# EAGLE design ESP-AXA (EAGLE 9.6.2)
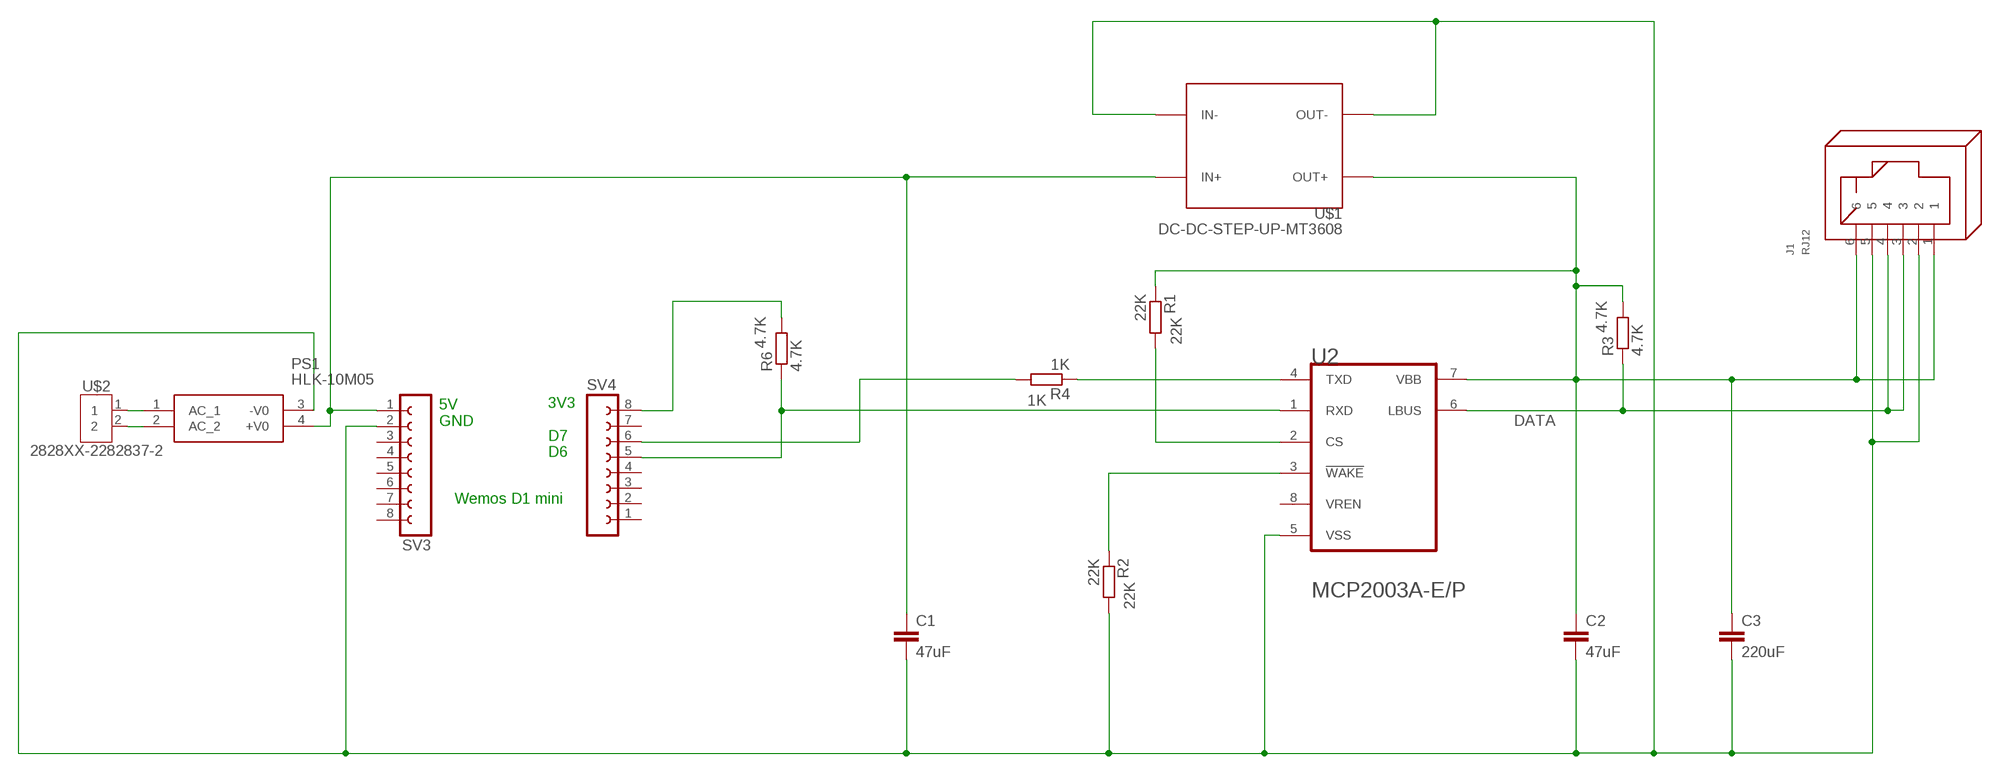
[diagram p0: schematic, sheet 1]

## Parts
C1  47uF  C7.5/3  [C7.5B3]
C2  47uF  C7.5/3  [C7.5B3]
C3  220uF  C7.5/3  [C7.5B3]
J1  RJ12  [RJ12]
PS1  HLK-10M05  [HLK10M05]
R1  22K  R-EU_0204/2V  [0204V]
R2  22K  R-EU_0204/2V  [0204V]
R3  4.7K  R-EU_0204/2V  [0204V]
R4  1K  R-EU_0204/2V  [0204V]
R6  4.7K  R-EU_0204/2V  [0204V]
SV3  FE08-1  [FE08]
SV4  FE08-1  [FE08]
U2  MICROCHIP_MCP2003A-E-PMICROCHIP_MCP2003A-E-P_0_0  [MICROCHIP_MCP2003A-E-P_0]
U$1  DC-DC-STEP-UP-MT3608  [DC-DC-STEP-UP-MT3608]
U$2  2828XX-2282837-2  [TERMBLK_508-2N]

## Nets
5V: C1.1 PS1.4(+V0) SV3.1 U$1.IN+
8V: C2.1 C3.1 J1.1 J1.6 R1.1 R3.2 U2.7(VBB) U$1.OUT+
240VAC: PS1.2(AC_2) U$2.2
CS: R1.2 U2.2(CS)
DATA: J1.3 J1.4 R3.1 U2.6(LBUS)
GND: C1.2 C2.2 C3.2 J1.2 J1.5 PS1.3(-V0) R2.2 SV3.2 U2.5(VSS) U$1.IN- U$1.OUT-
N$2: R4.2 SV4.6
N$8: R6.2 SV4.8
N$13: PS1.1(AC_1) U$2.1
RX: R6.1 SV4.5 U2.1(RXD)
TX: R4.1 U2.4(TXD)
WAKE: R2.1 U2.3(!WAKE!)
Unconnected: SV3.3 SV3.4 SV3.5 SV3.6 SV3.7 SV3.8 SV4.1 SV4.2 SV4.3 SV4.4 SV4.7 U2.8(VREN)

## Notes on the sheet
- 5V
  GND
- 3V3
  
  D7
  D6
- Wemos D1 mini

## Library data of the parts
C1-C3 = capacitor-wima:C: CAPACITOR naming: grid - package width
J1 = con-rj:RJ12: RJ12, RJ14 and RJ25 RJ12, RJ14 and RJ25 jacks side mounted http://www.tycoelectronics.com
PS1 = HLK-10M05:HLK-10M05: Power Module AC-DC Through Hole RoHS Source: Datasheet <https://datasheet.lcsc.com/szlcsc/1909111105_HI-LINK-HLK-10M05_C403745.pdf>; DESCRIPTION: Power Module AC-DC Through Hole RoHS; HEIGHT: 21.8mm; MANUFACTURER_NAME: Hi-Link; MANUFACTURER_PART_NUMBER: HLK-10M05
R1 R2 = resistor:R-EU_: RESISTOR, European symbol; R6: 22K
R3 R6 = resistor:R-EU_: RESISTOR, European symbol; R6: 4.7K
R4 = resistor:R-EU_: RESISTOR, European symbol; R6: 1K
SV3 SV4 = con-lsta:FE08-1: FEMALE HEADER; OC_FARNELL: unknown; OC_NEWARK: unknown
U2 = P:MICROCHIP_MCP2003A-E-P: COM-TRX-MCP2003-8; CIIVA_IDS: 1299907; CODE__JEDEC: MS-001; COMPONENT_LINK_1_DESCRIPTION: Manufacturer URL; COMPONENT_LINK_1_URL: http://www.microchip.com/; COMPONENT_LINK_3_DESCRIPTION: Package Specification; COMPONENT_LINK_3_URL: http://www.microchip.com/stellent/groups/techpub_sg/documents/packagingspec/en012702.pdf; DATASHEET: http://ww1.microchip.com/downloads/en/DeviceDoc/22230D.pdf; DATASHEET_VERSION: revD, Dec-2011; FOOTPRINT_VARIANT_NAME_0: Manufacturer Recommended; IMPORTED: yes; IMPORTED_FROM: vault; IMPORT_TS: 1521863626; MF: Microchip; MPN: MCP2003A-E/P; PACKAGE: PDIP300-P8; PACKAGE_DESCRIPTION: 8-Lead Plastic Dual In-Line (P) - 300 mil Body [PDIP]; PACKAGE_VERSION: revBB, Aug-2009; PREFIX: U; RELEASE_DATE: 1331939234; VAULT_GUID: FB2FFE58-7DD9-4D31-95F2-92BE603D219D; VAULT_REVISION: B3EF98D0-D24D-4868-A9FE-F3BF9F8E8227
U$1 = dc-dc-boost-2a-microusb-mt3608:DC-DC-STEP-UP-MT3608: DC/DC Step-Up Regulator based on MT3608 chip MT3608 datasheet available here: https://www.olimex.com/Products/Breadboarding/BB-PWR-3608/resources/MT3608.pdf Click here to find device on ebay.com <http://www.ebay.com/sch/mt3608+module>
U$2 = Connector:2828XX-2: 2 Position Wire to Board Terminal Block Horizontal with Board Datasheet <https://www.te.com.cn/commerce/DocumentDelivery/DDEController?Action=showdoc&DocId=Catalog+Section%7F1308389_EUROSTYLE_TERMINAL_BLOCKS%7F0607%7Fpdf%7FEnglish%7FENG_CS_1308389_EUROSTYLE_TERMINAL_BLOCKS_0607.pdf%7F2-282837-5>; CATEGORY: Connector; DESCRIPTION: 2 Position Wire to Board Terminal Block Horizontal with Board 5.08 mm Through Hole; MANUFACTURER: TE Connectivity; MPN: 282837-2; OPERATING_TEMPERATURE: -40°C to +105°C; PART_STATUS: ACTIVE; ROHS_COMPLIANCE: RoHS Compliant; SERIES: 282837; SUBCATEGORY: Terminal Block; TYPE: Side Wire Entry

## Board
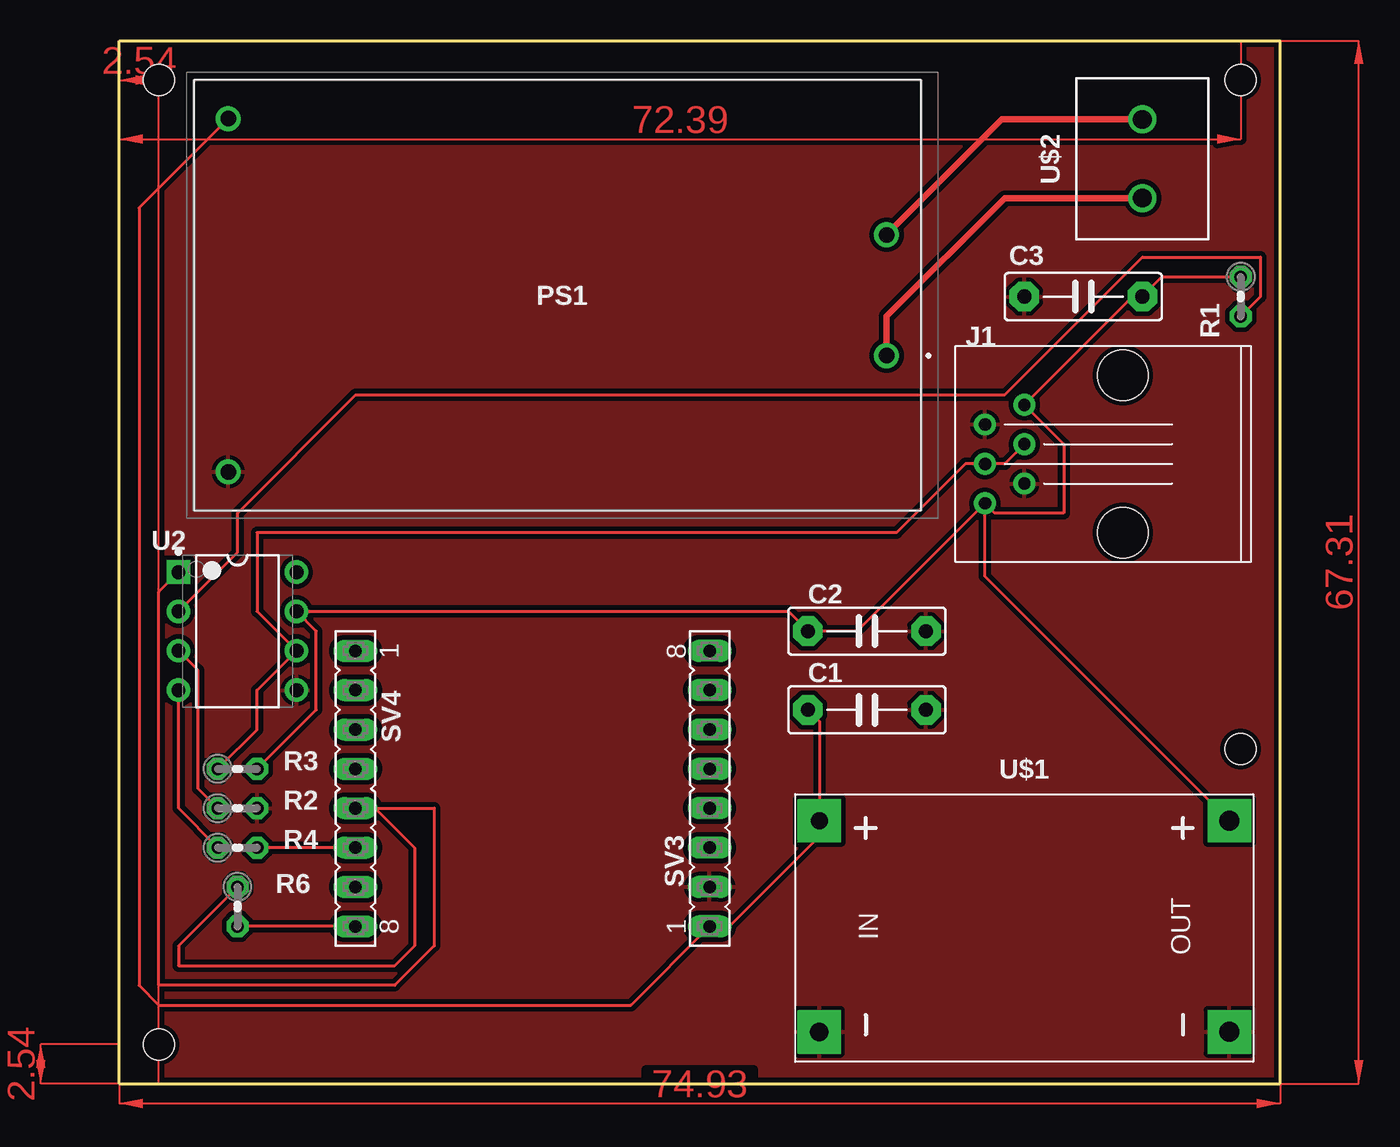
[diagram p1: board, top side]
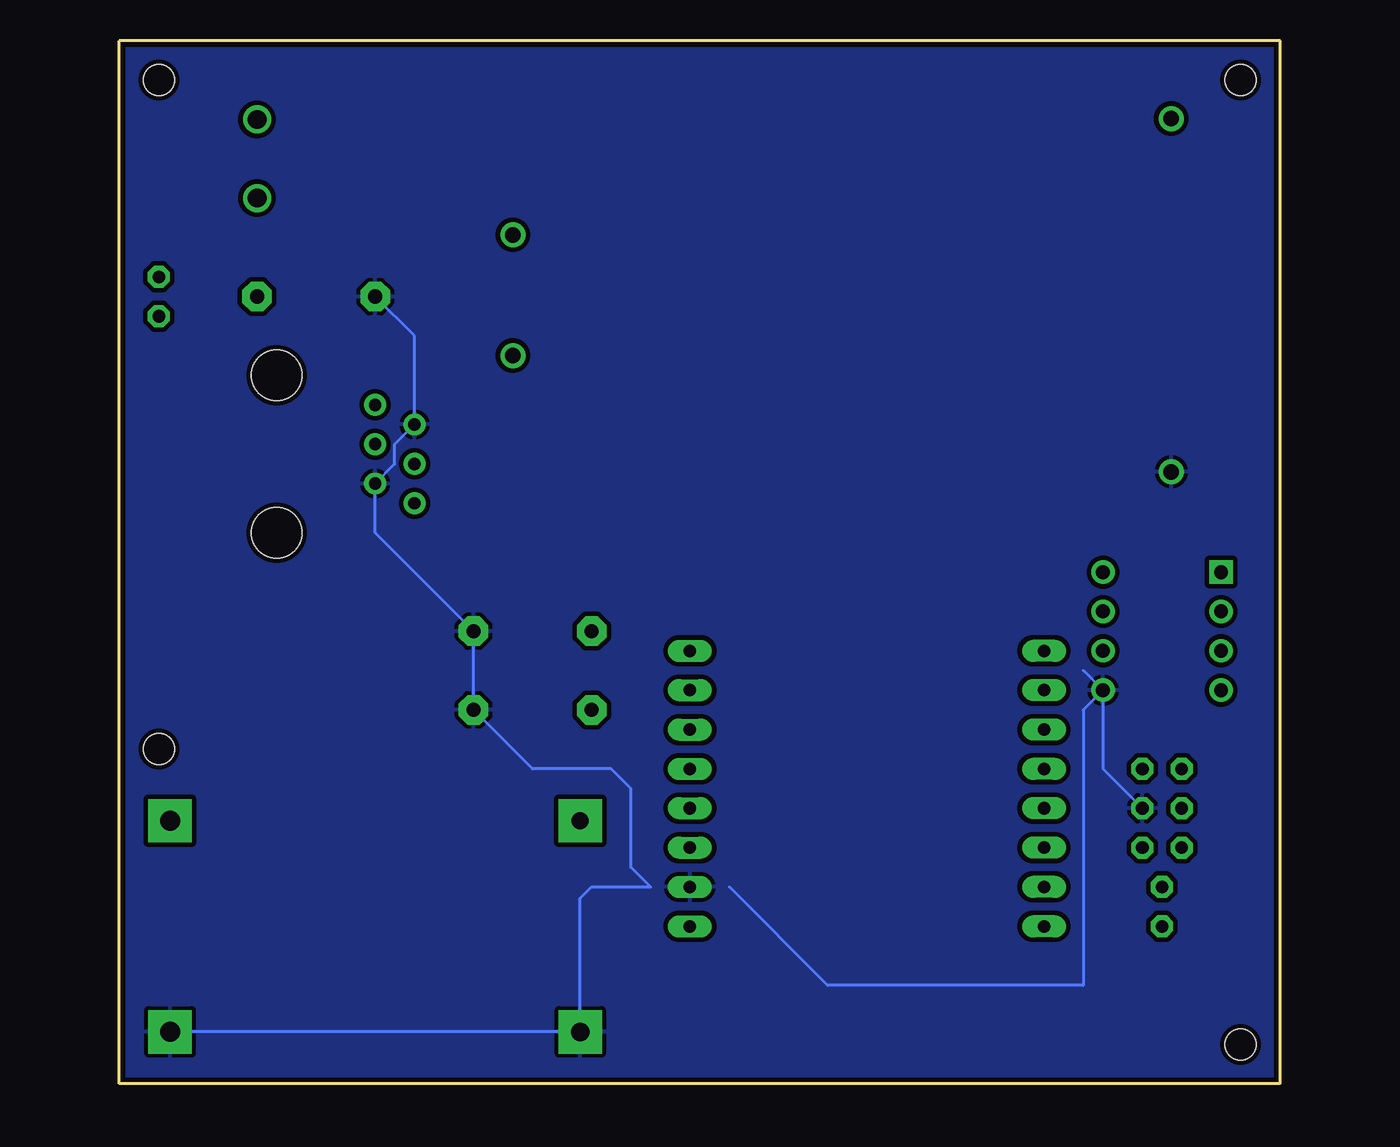
[diagram p2: board, bottom side, seen from below]

Size 74.93 x 67.31 mm. Coordinates in mm from the lower left corner, seen from the top.
Outline: 0,0 74.93,0 74.93,67.31 0,67.31 0,0
Copper layers (1*16): Top 0.035mm / dielectric 1.5mm / Bottom 0.035mm
Design rules "SparkFun": minimum track width 8mil, minimum drill 20mil, track to track 8mil, track to pad 8mil, pad to pad 8mil, via to via 8mil, smd to smd 8mil, copper to edge 8mil, drill to drill 8mil, minimum pad ring 12mil, minimum via ring 10mil, stop-mask expansion 4mil, vias tented up to drill 20mil, thermal gap 10mil
Holes 2 mm at 2.54,64.77 2.54,2.54 72.39,64.77 72.39,21.59

### Footprints (pad centres in the part's own frame; a part is rotated, then mirrored left to right if it is on the bottom)
C7.5B3 = drill 0.914 pad 1.905 octagon: 1 -3.81,0; 2 3.81,0
RJ12 = drill 0.8: 1 -8.89,-3.175; 2 -6.35,-1.905; 3 -8.89,-0.635; 4 -6.35,0.635; 5 -8.89,1.905; 6 -6.35,3.175 | hole 3.25: 0,-5.08; 0,5.08
HLK10M05 = drill 1 pad 1.5: 1 0,0; 2 0,-7.8; 3 42.5,7.5; 4 42.5,-15.3
0204V = drill 0.813 octagon: 1 -1.27,0; 2 1.27,0
FE08 = drill 0.813 long: 1 -8.89,0; 2 -6.35,0; 3 -3.81,0; 4 -1.27,0; 5 1.27,0; 6 3.81,0; 7 6.35,0; 8 8.89,0
MICROCHIP_MCP2003A-E-P_0 = drill 0.9 pad 1.5 square: 1 -3.81,3.81 | drill 0.9 pad 1.5: 2 -3.81,1.27; 3 -3.81,-1.27; 4 -3.81,-3.81; 5 3.81,-3.81; 6 3.81,-1.27; 7 3.81,1.27; 8 3.81,3.81
DC-DC-STEP-UP-MT3608 = drill 1.1 pad 2.8 square: IN+ -13.24,6.81 | drill 1.2 pad 2.8 square: IN- -13.24,-6.81 | drill 1.3 pad 2.8 square: OUT+ 13.24,6.81; OUT- 13.24,-6.81
TERMBLK_508-2N = drill 1.2: 1 0,0; 2 5.08,0

### Placement (x,y rotation side)
C1  48.26,24.13 0 top
C2  48.26,29.21 0 top
C3  62.23,50.8 180 top
J1  64.77,40.64 0 top
PS1  49.53,46.99 180 top
R1  72.39,50.8 270 top
R2  7.62,17.78 0 top
R3  7.62,20.32 0 top
R4  7.62,15.24 0 top
R6  7.62,11.43 270 top
SV3  38.1,19.05 90 top
SV4  15.24,19.05 270 top
U2  7.62,29.21 0 top
U$1  58.42,10.16 0 top
U$2  66.04,57.15 90 top

### Tracks (layer width: path | path; a pad name or v marks a point on that pad's centre or on a via)
5V
  Top 0.203: C1.1 45.18,23.4 U$1.IN+ 45.18,15.97 39.37,10.16 SV3.1 33.02,5.08 2.54,5.08 1.27,6.35 1.27,56.53 PS1.4
8V
  Top 0.203: R1.1 67.31,52.07 C3.1 65.41,50.8 J1.6 60.96,41.27 60.96,36.83 56.52,36.83 J1.1 | J1.1 47.62,29.21 C2.1 43.18,30.48 U2.7 12.7,29.21 12.7,24.13 R3.2 | U$1.OUT+ 55.88,32.75 J1.1
240VAC
  Top 0.406: PS1.2 56.97,62.23 U$2.2
CS
  Top 0.203: R1.2 73.66,50.8 73.66,53.34 66.04,53.34 57.15,44.45 15.24,44.45 7.62,36.83 7.62,34.29 U2.2
DATA
  Top 0.203: J1.4 57.15,40.01 J1.3 54.61,40.01 50.17,35.56 8.89,35.56 8.89,30.48 U2.6 8.89,25.4 8.89,22.86 R3.1
GND
  Bottom 0.203: C3.2 55.88,48.26 J1.5 57.15,41.27 57.15,40.01 J1.2 58.42,35.56 C2.2 C1.2 48.26,20.32 43.18,20.32 41.91,19.05 41.91,13.97 40.64,12.7 44.45,12.7 45.18,11.97 U$1.IN- U$1.OUT- | 12.7,26.67 U2.5 | U2.5 11.43,20.32 R2.2 | U2.5 12.7,24.13 12.7,6.35 29.21,6.35 35.56,12.7
  pour Top (isolate 0.305): 0,67.31 74.93,67.31 74.93,0 0,0
  pour Bottom (isolate 0.305): 0,67.31 74.93,67.31 74.93,0 0,0
N$2
  Top 0.203: SV4.6 R4.2
N$8
  Top 0.203: SV4.8 R6.2
N$13
  Top 0.406: PS1.1 49.53,49.53 57.15,57.15 U$2.1
RX
  Top 0.203: U2.1 2.54,31.75 2.54,6.35 17.78,6.35 20.32,8.89 20.32,17.78 SV4.5 16.51,17.78 19.05,15.24 19.05,8.89 17.78,7.62 3.81,7.62 3.81,8.89 R6.1
TX
  Top 0.203: R4.1 3.81,17.78 U2.4
WAKE
  Top 0.203: R2.1 5.08,19.05 5.08,26.67 U2.3
(copper drawn outside any net)
  shapes: Top area x7

### Text on the board
Document: L | N | RXD | 8V | CS | VREN | WAKE | Data | RST | TX | TXD | GND | A0 | RX | D0 | D1 | D5 | Wemos D1 mini | D2 | D6 | D3 | D7 | D4 | D8 | GND | 3V3 | 5V | ESP-AXA Remote Controller v1.01 / www.sydspost.nl